# Altium schematic sheet Power_Topology.SchDoc
size A; SheetNumber: 1; SheetTotal: 3
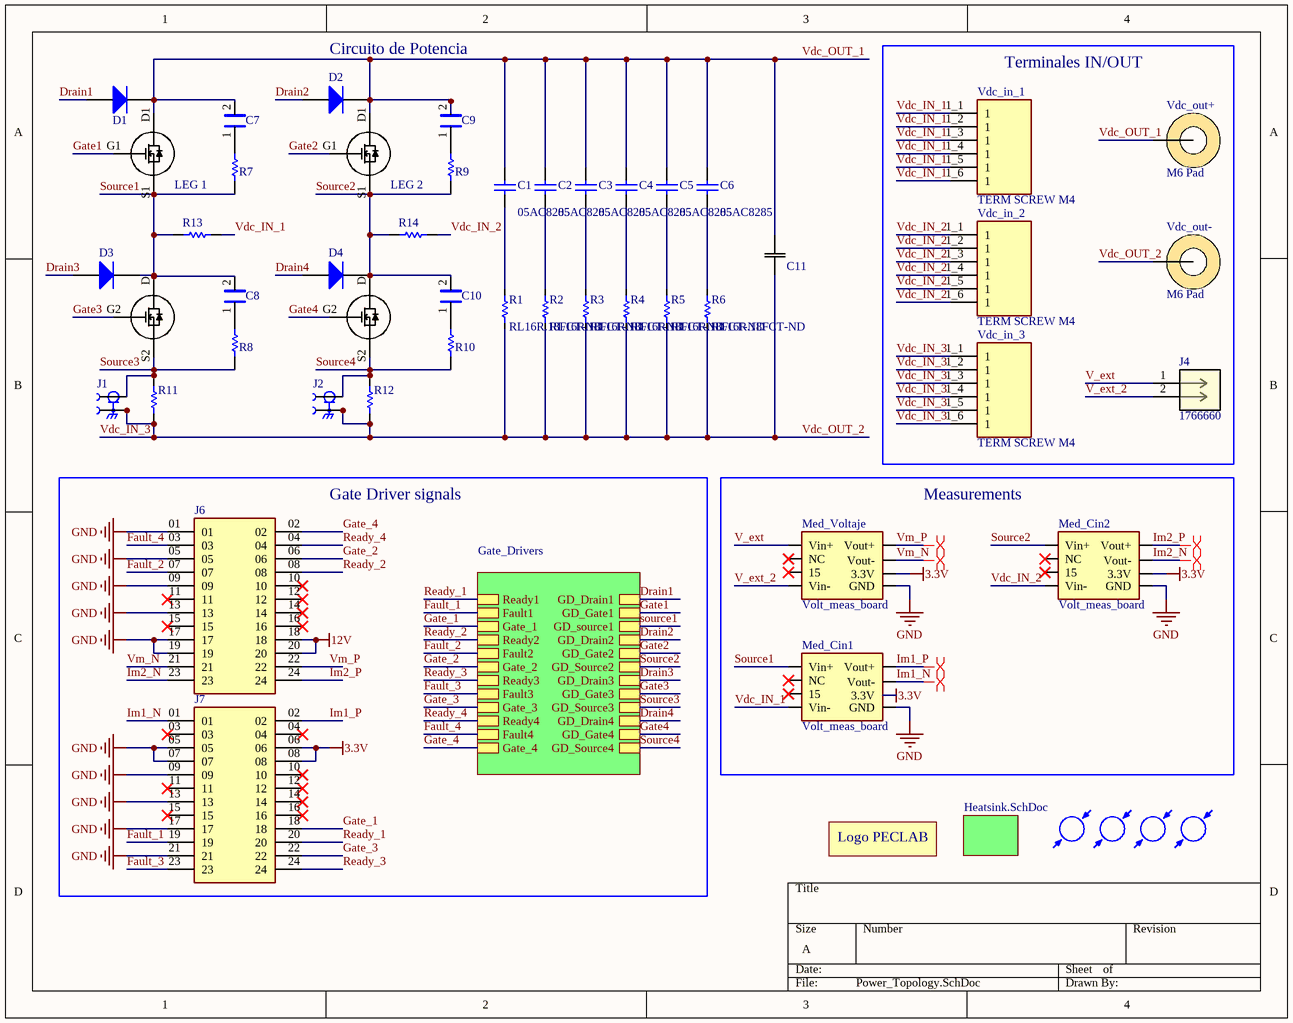
[diagram p0: Power_Topology.SchDoc]

## Parts
C1  Supplier Part Number 1: 05AC8285  [CAP_1812]  (hidden comment: C1812C471JDGACTU)
C2  Supplier Part Number 1: 05AC8285  [CAP_1812]  (hidden comment: C1812C471JDGACTU)
C3  Supplier Part Number 1: 05AC8285  [CAP_1812]  (hidden comment: C1812C471JDGACTU)
C4  Supplier Part Number 1: 05AC8285  [CAP_1812]  (hidden comment: C1812C471JDGACTU)
C5  Supplier Part Number 1: 05AC8285  [CAP_1812]  (hidden comment: C1812C471JDGACTU)
C6  Supplier Part Number 1: 05AC8285  [CAP_1812]  (hidden comment: C1812C471JDGACTU)
C7  C1808C681JGGAC7800  [CAPC4520X200N]  (value not drawn)
C8  C1808C681JGGAC7800  [CAPC4520X200N]  (value not drawn)
C9  C1808C681JGGAC7800  [CAPC4520X200N]  (value not drawn)
C10  C1808C681JGGAC7800  [CAPC4520X200N]  (value not drawn)
C11  C4AQIBU5125A12J  [CAP_C4AQ_B_2_KEM]  (value not drawn)
D1  ES1MTR  [SMA]  (value not drawn)
D2  ES1MTR  [SMA]  (value not drawn)
D3  ES1MTR  [SMA]  (value not drawn)
D4  ES1MTR  [SMA]  (value not drawn)
J1  CONUFL001-SMD-T  [LINX_CONUFL001-SMD-T]  (value not drawn)
J2  CONUFL001-SMD-T  [LINX_CONUFL001-SMD-T]  (value not drawn)
J4  1766660  [CONN_1766660]
J6  TSW-112-08-G-D-NA  [SAMTEC_TSW-112-08-G-D-NA]  (value not drawn)
J7  TSW-112-08-G-D-NA  [SAMTEC_TSW-112-08-G-D-NA]  (value not drawn)
LEG_1  MOSFET_SINK  [MOSFET-TO247_LEG_1]  (value not drawn)
LEG_2  MOSFET_SINK  [MOSFET-TO247_LEG_2]  (value not drawn)
Logo  LOGO PECLAB  [LOGO PECLAB 2]  (value not drawn)  (no BOM)
Med_Cin1  Volt_meas_board  [Volt_meas_board]
Med_Cin2  Volt_meas_board  [Volt_meas_board]
Med_Voltaje  Volt_meas_board  [Volt_meas_board]
MH1  (no value)  [MH_3.4]
MH2  (no value)  [MH_3.4]
MH3  (no value)  [MH_3.4]
MH4  (no value)  [MH_3.4]
R1  Supplier Part Number 1: RL16R.18FCT-ND  [R_1206]  (hidden comment: RL1632R-R180-F)
R2  Supplier Part Number 1: RL16R.18FCT-ND  [R_1206]  (hidden comment: RL1632R-R180-F)
R3  Supplier Part Number 1: RL16R.18FCT-ND  [R_1206]  (hidden comment: RL1632R-R180-F)
R4  Supplier Part Number 1: RL16R.18FCT-ND  [R_1206]  (hidden comment: RL1632R-R180-F)
R5  Supplier Part Number 1: RL16R.18FCT-ND  [R_1206]  (hidden comment: RL1632R-R180-F)
R6  Supplier Part Number 1: RL16R.18FCT-ND  [R_1206]  (hidden comment: RL1632R-R180-F)
R7  Res 2010 4.7 Ohms  [RESC5025X70N]  (value not drawn)
R8  Res 2010 4.7 Ohms  [RESC5025X70N]  (value not drawn)
R9  Res 2010 4.7 Ohms  [RESC5025X70N]  (value not drawn)
R10  Res 2010 4.7 Ohms  [RESC5025X70N]  (value not drawn)
R11  WSHP2818R0100FEB  [RES_WSHP2818_VIS]  (value not drawn)
R12  WSHP2818R0100FEB  [RES_WSHP2818_VIS]  (value not drawn)
R13  WSHP2818R0100FEB  [RES_WSHP2818_VIS]  (value not drawn)
R14  WSHP2818R0100FEB  [RES_WSHP2818_VIS]  (value not drawn)
Vdc_in_1  TERM SCREW M4  [KEYSTONE_7799]
Vdc_in_2  TERM SCREW M4  [KEYSTONE_7799]
Vdc_in_3  TERM SCREW M4  [KEYSTONE_7799]
Vdc_out+  M6 Pad  [M6 PAD Connector]  (no BOM)
Vdc_out-  M6 Pad  [M6 PAD Connector]  (no BOM)

## Blocks framed on the sheet
Terminales IN/OUT: J4 Vdc_in_1-Vdc_in_3 Vdc_out+ Vdc_out-
Gate Driver signals: J6 J7
Measurements: Med_Cin1 Med_Cin2 Med_Voltaje

## Sub-sheets
Gate_Drivers = Gate_drivers.SchDoc: Ready1, Fault1, Gate_1, GD_Drain1, GD_Gate1, GD_source1, GD_Drain2, GD_Gate2, GD_Source2, GD_Drain3, GD_Gate3, GD_Source3, GD_Drain4, GD_Gate4, GD_Source4, Ready2, Fault2, Gate_2, Ready3, Fault3, Gate_3, Ready4, Fault4, Gate_4
Heatsink = Heatsink.SchDoc: no entries

## Nets
3.3V: J7.06 J7.08 Med_Cin1.6(3.3V) Med_Cin2.6(3.3V) Med_Voltaje.6(3.3V)
12V: J6.18 J6.20
GND: J6.01 J6.05 J6.09 J6.13 J6.17 J6.19 J7.05 J7.07 J7.09 J7.13 J7.17 J7.21 Med_Cin1.7(GND) Med_Cin2.7(GND) Med_Voltaje.7(GND)
Drain1: D1.A ; sheet Gate_Drivers/GD_Drain1
Drain2: D2.A ; sheet Gate_Drivers/GD_Drain2
Drain3: D3.A ; sheet Gate_Drivers/GD_Drain3
Drain4: D4.A ; sheet Gate_Drivers/GD_Drain4
Fault_1: J7.19 ; sheet Gate_Drivers/Fault1
Fault_2: J6.07 ; sheet Gate_Drivers/Fault2
Fault_3: J7.23 ; sheet Gate_Drivers/Fault3
Fault_4: J6.03 ; sheet Gate_Drivers/Fault4
Gate1: LEG_1.G1 ; sheet Gate_Drivers/GD_Gate1
Gate2: LEG_2.G1 ; sheet Gate_Drivers/GD_Gate2
Gate3: LEG_1.G2 ; sheet Gate_Drivers/GD_Gate3
Gate4: LEG_2.G2 ; sheet Gate_Drivers/GD_Gate4
Gate_1: J7.18 ; sheet Gate_Drivers/Gate_1
Gate_2: J6.06 ; sheet Gate_Drivers/Gate_2
Gate_3: J7.22 ; sheet Gate_Drivers/Gate_3
Gate_4: J6.02 ; sheet Gate_Drivers/Gate_4
Im1_N: J7.01 Med_Cin1.5(Vout-)
Im1_P: J7.02 Med_Cin1.4(Vout+)
Im2_N: J6.23 Med_Cin2.5(Vout-)
Im2_P: J6.24 Med_Cin2.4(Vout+)
Ready_1: J7.20 ; sheet Gate_Drivers/Ready1
Ready_2: J6.08 ; sheet Gate_Drivers/Ready2
Ready_3: J7.24 ; sheet Gate_Drivers/Ready3
Ready_4: J6.04 ; sheet Gate_Drivers/Ready4
Source1: C8.2 D3.K LEG_1.D LEG_1.S1 Med_Cin1.0(Vin+) R7.1 R13.1 ; sheet Gate_Drivers/GD_source1
Source2: C10.2 D4.K LEG_2.D LEG_2.S1 Med_Cin2.0(Vin+) R9.1 R14.1 ; sheet Gate_Drivers/GD_Source2
Source3: J1.1 LEG_1.S2 R8.1 R11.1 ; sheet Gate_Drivers/GD_Source3
Source4: J2.1 LEG_2.S2 R10.1 R12.1 ; sheet Gate_Drivers/GD_Source4
V_ext: J4.1 Med_Voltaje.0(Vin+)
V_ext_2: J4.2 Med_Voltaje.3(Vin-)
Vdc_IN_1: Med_Cin1.3(Vin-) R13.2 Vdc_in_1.1_1(1) Vdc_in_1.1_2(1) Vdc_in_1.1_3(1) Vdc_in_1.1_4(1) Vdc_in_1.1_5(1) Vdc_in_1.1_6(1)
Vdc_IN_2: Med_Cin2.3(Vin-) R14.2 Vdc_in_2.1_1(1) Vdc_in_2.1_2(1) Vdc_in_2.1_3(1) Vdc_in_2.1_4(1) Vdc_in_2.1_5(1) Vdc_in_2.1_6(1)
Vdc_IN_3: C11.1 J1.2 J1.3 J2.2 J2.3 R1.1 R2.1 R3.1 R4.1 R5.1 R6.1 R11.2 R12.2 Vdc_in_3.1_1(1) Vdc_in_3.1_2(1) Vdc_in_3.1_3(1) Vdc_in_3.1_4(1) Vdc_in_3.1_5(1) Vdc_in_3.1_6(1) Vdc_out-.1  [also labelled Vdc_OUT_2]
Vdc_OUT_1: C1.1 C2.1 C3.1 C4.1 C5.1 C6.1 C7.2 C9.2 C11.2 D1.K D2.K LEG_1.D1 LEG_2.D1 Vdc_out+.1
Vm_N: J6.21 Med_Voltaje.5(Vout-)
Vm_P: J6.22 Med_Voltaje.4(Vout+)
NetC1_2: C1.2 R1.2
NetC2_2: C2.2 R2.2
NetC3_2: C3.2 R3.2
NetC4_2: C4.2 R4.2
NetC5_2: C5.2 R5.2
NetC6_2: C6.2 R6.2
NetC7_1: C7.1 R7.2
NetC8_1: C8.1 R8.2
NetC9_1: C9.1 R9.2
NetC10_1: C10.1 R10.2

Not connected (* = marked no-connect by the designer): J6 10* 11* 12* 14* 15* 16*; J7 03* 04* 10* 11* 12* 14* 15* 16*; Med_Cin1 1(NC)* 2(15)*; Med_Cin2 1(NC)* 2(15)*; Med_Voltaje 1(NC)* 2(15)*

## Layout directives
differential pair: Im1_N, Im1_P, Im2_N, Im2_P, Vm_N, Vm_P

## Notes on the sheet
- Circuito de Potencia
- (in symbol LOGO PECLAB) Logo PECLAB

## Library data of the parts
C1-C6 = C1812C471JDGACTU: Cap Ceramic 470pF 1000V C0G 5% SMD 1812 125°C Embossed Plastic T/R; Manufacturer: KEMET; Voltage Rating: 1kV; Supplier 1: Newark; Manufacturer Part Number: C1812C471JDGACTU; RoHS: Yes; Category: Ceramic Capacitors; Stock 1: 614; Pricing 1: 1=1,23000, 10=1,18000, 25=1,17000, 50=1,16000, 100=1,16000 (USD); Mount: Surface Mount; Case/Package: 1812; Dielectric Material: Ceramic; Min Operating Temperature: -55°C; Max Operating Temperature: 125°C; Capacitance: 470pF; Dielectric: C0G; Packaging: Tape and Reel; Tolerance: 5%; Voltage Rating (DC): 1kV; Length: 0.177inch; Width: 0.126inch; Thickness: 0.071inch; Lead Free: Lead Free
C7-C10 = CAP CER 680PF 1808: CAP CER 680PF 2KV C0G/NP0 1808; MF: KEMET; Package: 1808 (4520 Metric); Price: None; Value: 680 pF; MP: C1808C681JGGAC7800; Availability: Unavailable
C11 = Cap Film 12.5 uF: 12.5 µF Film Capacitor 800V Polypropylene (PP), Metallized Radial; Mfr_Name: Kemet
D1-D4 = Diode_1: Diode Standard 1000 V 1A Surface Mount SMA; MF: SMC Diode Solutions; MFP: ES1MTR; Created: 2021_05_16_EDuran; Package: SMA; Value: ES1MTR; Supplier 1: Digi-Key; Supplier Part Number 1: 1655-1736-1-ND
J1 J2 = CONUFL001-SMD-T: U.FL (UMCC) Connector Jack, Male Pin 50Ohm Surface Mount Solder; MF: Linx; Price: None; MP: CONUFL001-SMD-T; Package: None; Value: *; Check_prices: https://www.snapeda.com/parts/CONUFL001-SMD-T/Linx/view-part/?ref=eda; Availability: Unavailable; SnapEDA_Link: https://www.snapeda.com/parts/CONUFL001-SMD-T/Linx/view-part/?ref=snap
J4 = 1766660: No Description Available; Mfr_Name: Phoenix Contact; RefDes: RefDes; Type: Type
J6 J7 = TSW-112-08-G-D-NA: Conn Unshrouded Header HDR 24 POS 2.54mm Solder RA Side Entry Thru-Hole Bulk; MF: Samtec; Package: None; Price: None; Check_prices: https://www.snapeda.com/parts/TSW-112-08-G-D-NA/Samtec/view-part/?ref=eda; Value: *; SnapEDA_Link: https://www.snapeda.com/parts/TSW-112-08-G-D-NA/Samtec/view-part/?ref=snap; MP: TSW-112-08-G-D-NA; Availability: In Stock; Purchase-URL: https://pricing.snapeda.com/search/part/TSW-112-08-G-D-NA/?ref=eda
LEG_1 = MOSFET_2_SINK_LEG_2: pin to pad: D>5 D1>2 D2>5 G1>1 G2>4 S1>3 S2>6; Part Number DK: C40-058-VE-ND
LEG_2 = MOSFET_2_SINK_LEG_2: pin to pad: D>5 D1>2 G1>1 G2>4 S1>3 S2>6; Part Number DK: C40-058-VE-ND
Med_Cin1 Med_Cin2 Med_Voltaje = Volt_meas_board: Tarjeta de medicion de voltaje con conector receptor 4 pos 2.54mm; pin to pad: 0>1 1>2 2>3 3>4 4>5 5>6 6>7 7>8; MF: Harwin Inc; MP: M20-7820446; Value: 2.54mm; Package: 4 pos
MH1-MH4 = Mounting Hole: Non plated through hole
R1-R6 = RL1632R-R180-F: Res Thin Film 1206 0.18 Ohm 1% 0.5W(1/2W) 0ppm/C to 100ppm/C Molded SMD Automotive T/R; Manufacturer: Susumu; Resistance: 180mR; Power Rating: 500mW; Temperature Coefficient: 100ppm/°C; Supplier 1: Digi-Key; Manufacturer Part Number: RL1632R-R180-F; RoHS: No; Category: Chip SMD Resistors; Stock 1: 112939; Pricing 1: 1=0,59000, 10=0,42400, 25=0,33080, 50=0,28000, 100=0,22060, 250=0,18664, 500=0,15272, 1000=0,11878 (USD); Case/Package: 1206; Number of Pins: 2; Case Code (Metric): 3216; Case Code (Imperial): 1206; Weight: 0.000571oz; Size Code: 1206; Min Operating Temperature: -55°C; Max Operating Temperature: 125°C; Tolerance: 1%; Package Quantity: 1; Packaging: Cut Tape; Resistor Type: Thin Film; Number of Terminations: 2; Termination: SMD/SMT; Max Power Dissipation: 500mW; Series: RL; Technology: THIN FILM; Resistance Tolerance: 1%; Length: 0.126inch; Width: 0.063inch; Height: 0.026inch; REACH SVHC: Unknown; Lead Free: Lead Free; ComponentLink1URL: https://datasheet.ciiva.com/12913/e-15-16-12913646.pdf?src-supplier=Mouser; ComponentLink1Description: https://datasheet.ciiva.com/12913/e-15-16-12913646.pdf?src-supplier=Mouser; ComponentLink2URL: https://datasheet.ciiva.com/2490/rl-data-sheet-2490371.pdf?src-supplier=Digi-Key; ComponentLink2Description: https://datasheet.ciiva.com/2490/rl-data-sheet-2490371.pdf?src-supplier=Digi-Key; ComponentLink3URL: https://datasheet.ciiva.com/2490/rl-data-sheet-2490370.pdf?src-supplier=Digi-Key; ComponentLink3Description: https://datasheet.ciiva.com/2490/rl-data-sheet-2490370.pdf?src-supplier=Digi-Key; ComponentLink4URL: https://datasheet.ciiva.com/2490/rl-data-sheet-2490372.pdf?src-supplier=Digi-Key; ComponentLink4Description: https://datasheet.ciiva.com/2490/rl-data-sheet-2490372.pdf?src-supplier=Digi-Key
R7-R10 = Res 2010 4.7 Ohms: 4.7 Ohms ±5% 1W Chip Resistor 2010 (5025 Metric) Automotive AEC-Q200, Pulse Withstanding Thick Film; MF: Vishay Dale; MP: CRCW20104R70JNEFHP; Package: 2010 (5025 Metric); Price: None; Value: 4.7 Ohms; Availability: Unavailable
R11-R14 = WSHP2818R0100FEB: Current Sense Resistors - SMD 10watt .01ohm 1% AEC-Q200; Mfr_Name: Vishay
Vdc_in_1-Vdc_in_3 = TERM SCREW M4: M4 Snap In PC Mount 30Amp-w Screw Unassembled; Value: M4 6 pin PCB; MF: Keystone; MP: 7799; Purchase-URL: https://pricing.snapeda.com/search/part/7799/?ref=eda; Package: None; Check_prices: https://www.snapeda.com/parts/7799/Keystone/view-part/?ref=eda; Price: None; Availability: In Stock; SnapEDA_Link: https://www.snapeda.com/parts/7799/Keystone/view-part/?ref=snap
Vdc_out+ Vdc_out- = Con_Pad_M6: Pad M6; Created: 2021_07_09_DArancibia; Value: M6 Pad